# Altium schematic sheet FM375_LQFP64_SOCKET.SchDoc
size A3
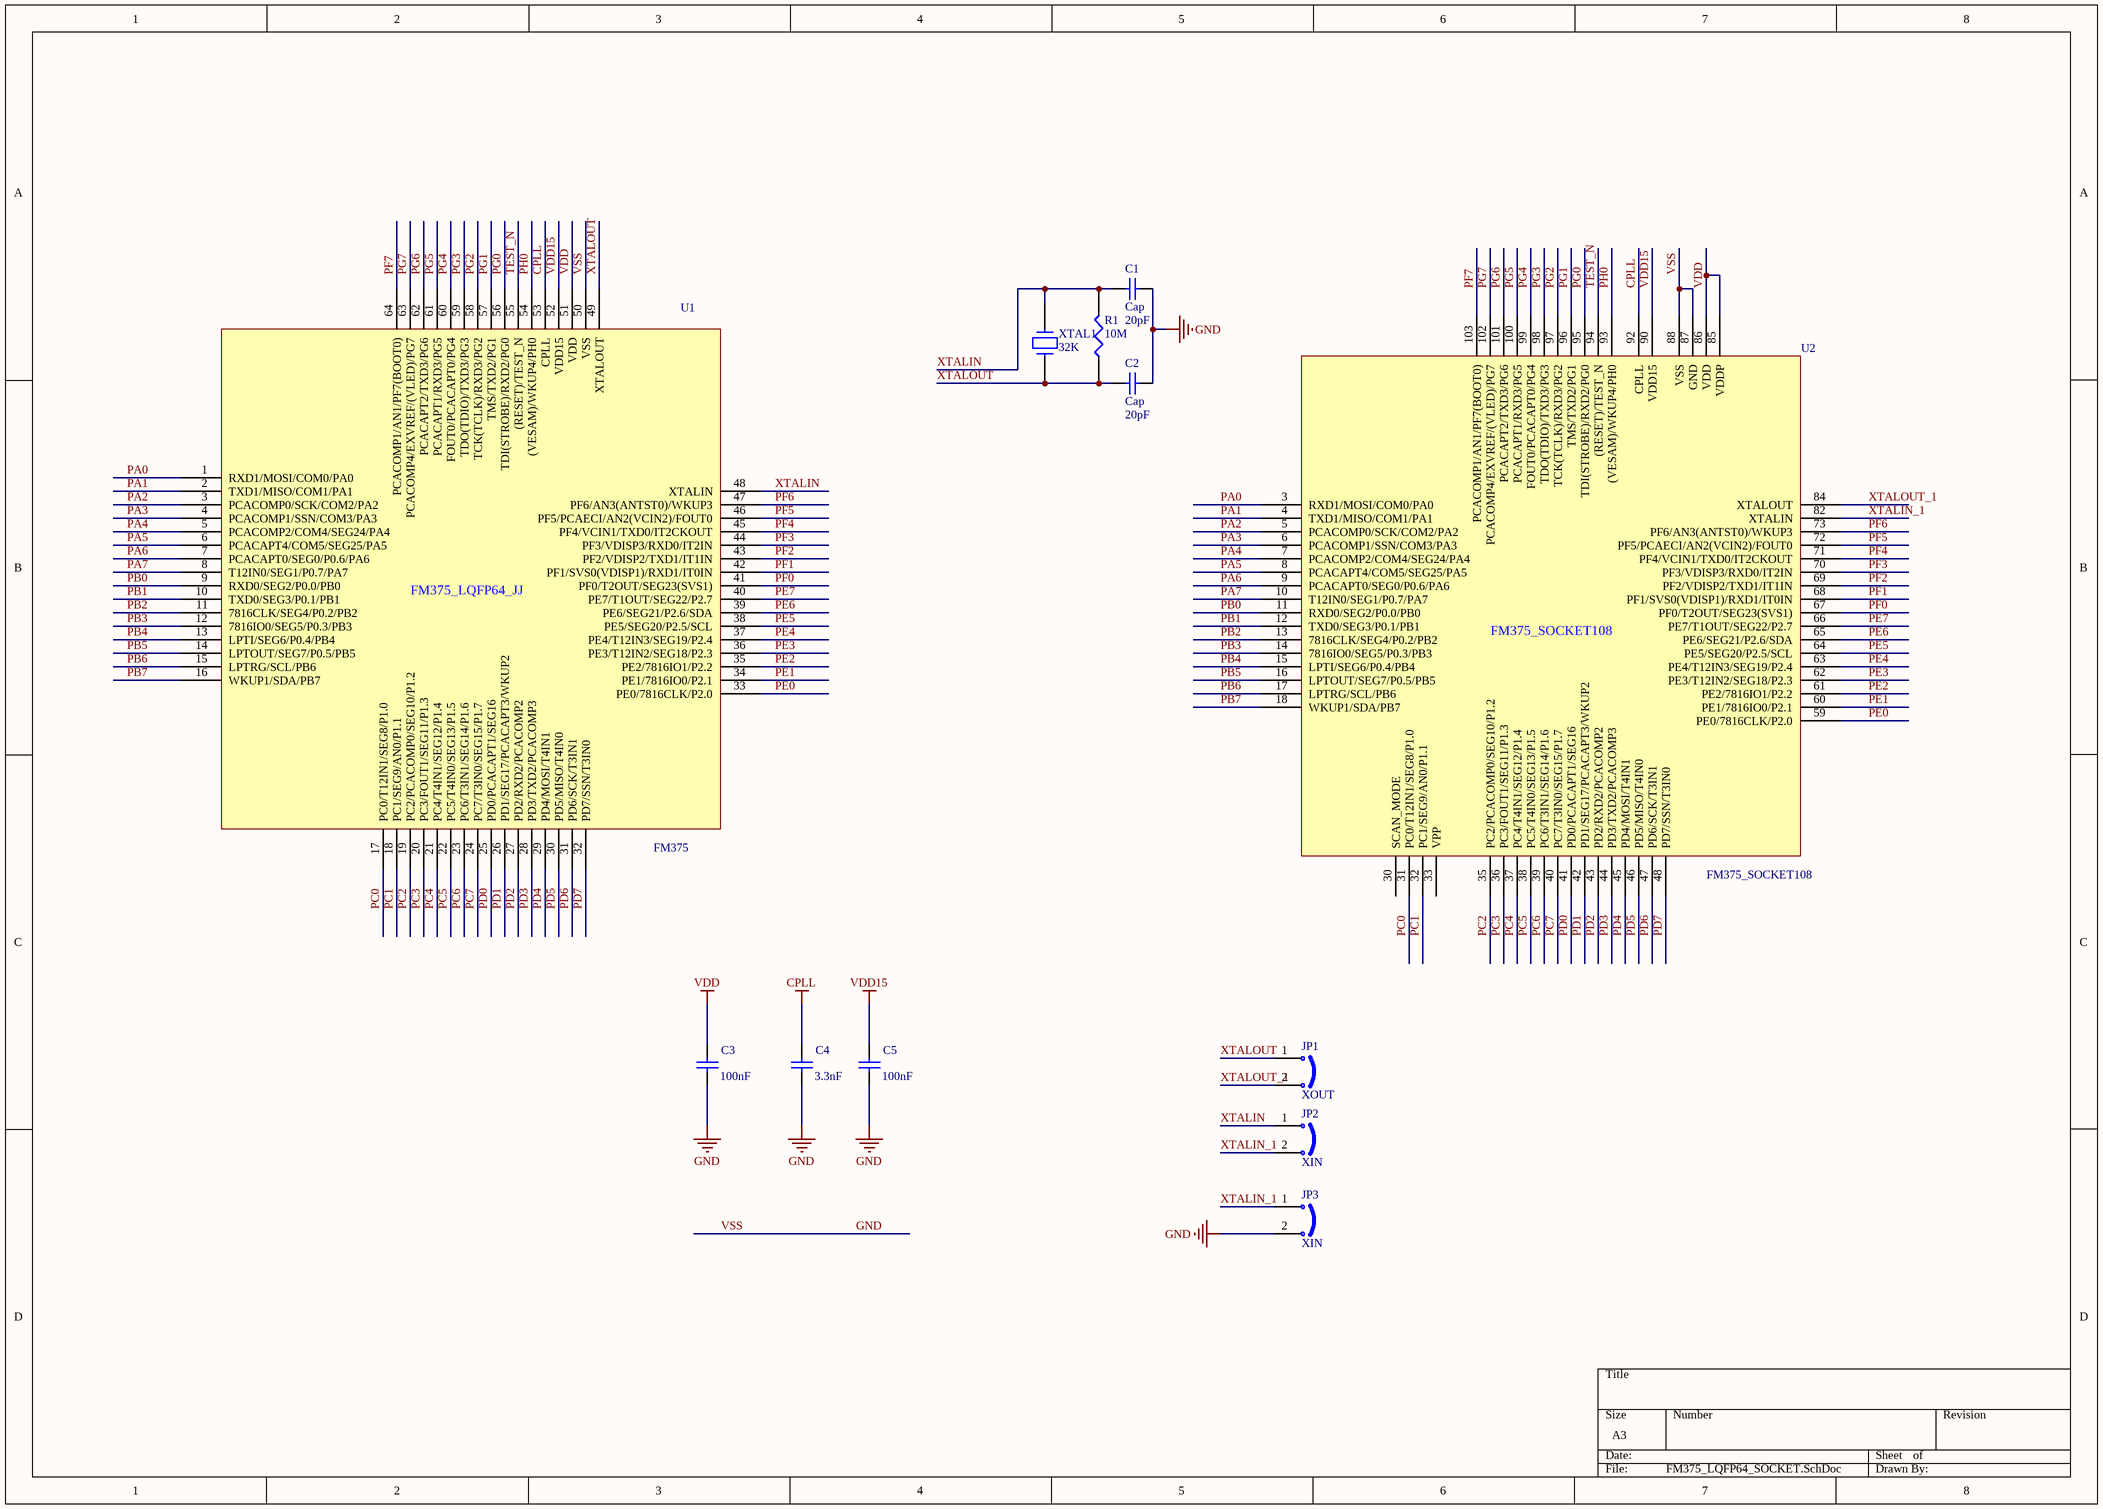
[diagram p0: FM375_LQFP64_SOCKET.SchDoc]

## Parts
C1  Cap  value 20pF  [0805]
C2  Cap  value 20pF  [0805]
C3  100nF  [0805]
C4  3.3nF  [0805]
C5  100nF  [0805]
JP1  XOUT  [0603_SHORT]
JP2  XIN  [0603_SHORT]
JP3  XIN  [0603_SHORT]
R1  10M  [0805]
U1  FM375  [QFP64_10*10_JJ]
U2  FM375_SOCKET108  [SOCKET108_LARGE]
XTAL1  32K  [XTAL-RB32K_2]

## Nets
CPLL: C4.2 U1.53(CPLL) U2.92(CPLL)
GND: C1.2 C2.2 C3.1 C4.1 C5.1 JP3.2 U1.50(VSS) U2.87(GND) U2.88(VSS)  [also labelled VSS]
VDD: C3.2 U1.51(VDD) U2.85(VDDP) U2.86(VDD)
VDD15: C5.2 U1.52(VDD15) U2.90(VDD15)
PA0: U1.1(RXD1/MOSI/COM0/PA0) U2.3(RXD1/MOSI/COM0/PA0)
PA1: U1.2(TXD1/MISO/COM1/PA1) U2.4(TXD1/MISO/COM1/PA1)
PA2: U1.3(PCACOMP0/SCK/COM2/PA2) U2.5(PCACOMP0/SCK/COM2/PA2)
PA3: U1.4(PCACOMP1/SSN/COM3/PA3) U2.6(PCACOMP1/SSN/COM3/PA3)
PA4: U1.5(PCACOMP2/COM4/SEG24/PA4) U2.7(PCACOMP2/COM4/SEG24/PA4)
PA5: U1.6(PCACAPT4/COM5/SEG25/PA5) U2.8(PCACAPT4/COM5/SEG25/PA5)
PA6: U1.7(PCACAPT0/SEG0/P0.6/PA6) U2.9(PCACAPT0/SEG0/P0.6/PA6)
PA7: U1.8(T12IN0/SEG1/P0.7/PA7) U2.10(T12IN0/SEG1/P0.7/PA7)
PB0: U1.9(RXD0/SEG2/P0.0/PB0) U2.11(RXD0/SEG2/P0.0/PB0)
PB1: U1.10(TXD0/SEG3/P0.1/PB1) U2.12(TXD0/SEG3/P0.1/PB1)
PB2: U1.11(7816CLK/SEG4/P0.2/PB2) U2.13(7816CLK/SEG4/P0.2/PB2)
PB3: U1.12(7816IO0/SEG5/P0.3/PB3) U2.14(7816IO0/SEG5/P0.3/PB3)
PB4: U1.13(LPTI/SEG6/P0.4/PB4) U2.15(LPTI/SEG6/P0.4/PB4)
PB5: U1.14(LPTOUT/SEG7/P0.5/PB5) U2.16(LPTOUT/SEG7/P0.5/PB5)
PB6: U1.15(LPTRG/SCL/PB6) U2.17(LPTRG/SCL/PB6)
PB7: U1.16(WKUP1/SDA/PB7) U2.18(WKUP1/SDA/PB7)
PC0: U1.17(PC0/T12IN1/SEG8/P1.0) U2.31(PC0/T12IN1/SEG8/P1.0)
PC1: U1.18(PC1/SEG9/AN0/P1.1) U2.32(PC1/SEG9/AN0/P1.1)
PC2: U1.19(PC2/PCACOMP0/SEG10/P1.2) U2.35(PC2/PCACOMP0/SEG10/P1.2)
PC3: U1.20(PC3/FOUT1/SEG11/P1.3) U2.36(PC3/FOUT1/SEG11/P1.3)
PC4: U1.21(PC4/T4IN1/SEG12/P1.4) U2.37(PC4/T4IN1/SEG12/P1.4)
PC5: U1.22(PC5/T4IN0/SEG13/P1.5) U2.38(PC5/T4IN0/SEG13/P1.5)
PC6: U1.23(PC6/T3IN1/SEG14/P1.6) U2.39(PC6/T3IN1/SEG14/P1.6)
PC7: U1.24(PC7/T3IN0/SEG15/P1.7) U2.40(PC7/T3IN0/SEG15/P1.7)
PD0: U1.25(PD0/PCACAPT1/SEG16) U2.41(PD0/PCACAPT1/SEG16)
PD1: U1.26(PD1/SEG17/PCACAPT3/WKUP2) U2.42(PD1/SEG17/PCACAPT3/WKUP2)
PD2: U1.27(PD2/RXD2/PCACOMP2) U2.43(PD2/RXD2/PCACOMP2)
PD3: U1.28(PD3/TXD2/PCACOMP3) U2.44(PD3/TXD2/PCACOMP3)
PD4: U1.29(PD4/MOSI/T4IN1) U2.45(PD4/MOSI/T4IN1)
PD5: U1.30(PD5/MISO/T4IN0) U2.46(PD5/MISO/T4IN0)
PD6: U1.31(PD6/SCK/T3IN1) U2.47(PD6/SCK/T3IN1)
PD7: U1.32(PD7/SSN/T3IN0) U2.48(PD7/SSN/T3IN0)
PE0: U1.33(PE0/7816CLK/P2.0) U2.59(PE0/7816CLK/P2.0)
PE1: U1.34(PE1/7816IO0/P2.1) U2.60(PE1/7816IO0/P2.1)
PE2: U1.35(PE2/7816IO1/P2.2) U2.61(PE2/7816IO1/P2.2)
PE3: U1.36(PE3/T12IN2/SEG18/P2.3) U2.62(PE3/T12IN2/SEG18/P2.3)
PE4: U1.37(PE4/T12IN3/SEG19/P2.4) U2.63(PE4/T12IN3/SEG19/P2.4)
PE5: U1.38(PE5/SEG20/P2.5/SCL) U2.64(PE5/SEG20/P2.5/SCL)
PE6: U1.39(PE6/SEG21/P2.6/SDA) U2.65(PE6/SEG21/P2.6/SDA)
PE7: U1.40(PE7/T1OUT/SEG22/P2.7) U2.66(PE7/T1OUT/SEG22/P2.7)
PF0: U1.41(PF0/T2OUT/SEG23(SVS1)) U2.67(PF0/T2OUT/SEG23(SVS1))
PF1: U1.42(PF1/SVS0(VDISP1)/RXD1/IT0IN) U2.68(PF1/SVS0(VDISP1)/RXD1/IT0IN)
PF2: U1.43(PF2/VDISP2/TXD1/IT1IN) U2.69(PF2/VDISP2/TXD1/IT1IN)
PF3: U1.44(PF3/VDISP3/RXD0/IT2IN) U2.70(PF3/VDISP3/RXD0/IT2IN)
PF4: U1.45(PF4/VCIN1/TXD0/IT2CKOUT) U2.71(PF4/VCIN1/TXD0/IT2CKOUT)
PF5: U1.46(PF5/PCAECI/AN2(VCIN2)/FOUT0) U2.72(PF5/PCAECI/AN2(VCIN2)/FOUT0)
PF6: U1.47(PF6/AN3(ANTST0)/WKUP3) U2.73(PF6/AN3(ANTST0)/WKUP3)
PF7: U1.64(PCACOMP1/AN1/PF7(BOOT0)) U2.103(PCACOMP1/AN1/PF7(BOOT0))
PG0: U1.56(TDI(STROBE)/RXD2/PG0) U2.95(TDI(STROBE)/RXD2/PG0)
PG1: U1.57(TMS/TXD2/PG1) U2.96(TMS/TXD2/PG1)
PG2: U1.58(TCK(TCLK)/RXD3/PG2) U2.97(TCK(TCLK)/RXD3/PG2)
PG3: U1.59(TDO(TDIO)/TXD3/PG3) U2.98(TDO(TDIO)/TXD3/PG3)
PG4: U1.60(FOUT0/PCACAPT0/PG4) U2.99(FOUT0/PCACAPT0/PG4)
PG5: U1.61(PCACAPT1/RXD3/PG5) U2.100(PCACAPT1/RXD3/PG5)
PG6: U1.62(PCACAPT2/TXD3/PG6) U2.101(PCACAPT2/TXD3/PG6)
PG7: U1.63(PCACOMP4/EXVREF/(VLED)/PG7) U2.102(PCACOMP4/EXVREF/(VLED)/PG7)
PH0: U1.54((VESAM)/WKUP4/PH0) U2.93((VESAM)/WKUP4/PH0)
TEST_N: U1.55((RESET)/TEST_N) U2.94((RESET)/TEST_N)
XTALIN: C1.1 JP2.1 R1.2 U1.48(XTALIN) XTAL1.1
XTALIN_1: JP2.2 JP3.1 U2.82(XTALIN)
XTALOUT: C2.1 JP1.1 R1.1 U1.49(XTALOUT) XTAL1.2
XTALOUT_1: JP1.2 U2.84(XTALOUT)

Not connected (* = marked no-connect by the designer): U2 30(SCAN_MODE) 33(VPP)

## Notes on the sheet
- (in symbol LQFP64-JJ) FM375_LQFP64_JJ

## Library data of the parts
C1-C3 = Cap: Capacitor; Published: 8-Jun-2000; LatestRevisionDate: 17-Jul-2002; LatestRevisionNote: Re-released for DXP Platform.; PackageReference: RAD-0.3; Publisher: Altium Limited
  C3: Value: 100nF
C4 = Cap: Capacitor; Value: 100nF; Published: 8-Jun-2000; LatestRevisionDate: 17-Jul-2002; LatestRevisionNote: Re-released for DXP Platform.; PackageReference: RAD-0.3; Publisher: Altium Limited
C5 = Cap: Capacitor; Value: 1nF; Published: 8-Jun-2000; LatestRevisionDate: 17-Jul-2002; LatestRevisionNote: Re-released for DXP Platform.; PackageReference: RAD-0.3; Publisher: Altium Limited
JP1-JP3 = JUMPER
R1 = RES1
U1 = LQFP64-JJ
XTAL1 = CRYSTAL